# EAGLE schematic bnc (EAGLE 9.0.1)
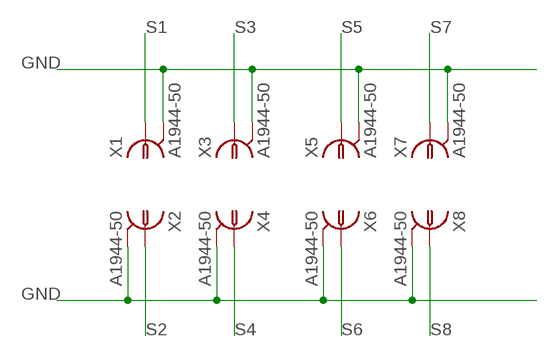
[diagram p0: schematic, sheet 1]

## Parts
X1  A1944-50  [A1944]
X2  A1944-50  [A1944]
X3  A1944-50  [A1944]
X4  A1944-50  [A1944]
X5  A1944-50  [A1944]
X6  A1944-50  [A1944]
X7  A1944-50  [A1944]
X8  A1944-50  [A1944]

## Nets
GND: X1.2 X1.3 X1.4 X1.5 X2.2 X2.3 X2.4 X2.5 X3.2 X3.3 X3.4 X3.5 X4.2 X4.3 X4.4 X4.5 X5.2 X5.3 X5.4 X5.5 X6.2 X6.3 X6.4 X6.5 X7.2 X7.3 X7.4 X7.5 X8.2 X8.3 X8.4 X8.5
S1: X1.1
S2: X2.1
S3: X3.1
S4: X4.1
S5: X5.1
S6: X6.1
S7: X7.1
S8: X8.1

## Library data of the parts
X1-X8 = con-coax:A1944-50: BNC CONNECTOR 50 Ohm distributor Buerklin 78F2475; OC_FARNELL: unknown; OC_NEWARK: unknown